# EAGLE design SO-8-minimal (EAGLE 6.5.0)
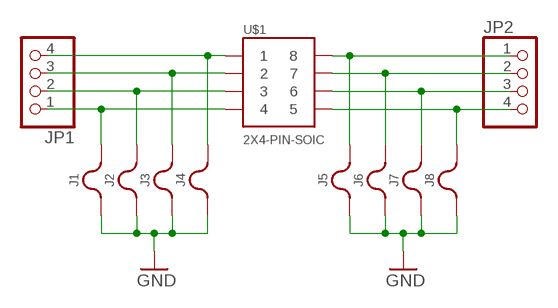
[diagram p0: schematic, sheet 1]

## Parts
J1  JUMPER-0805  [RCLJ-0805]
J2  JUMPER-0805  [RCLJ-0805]
J3  JUMPER-0805  [RCLJ-0805]
J4  JUMPER-0805  [RCLJ-0805]
J5  JUMPER-0805  [RCLJ-0805]
J6  JUMPER-0805  [RCLJ-0805]
J7  JUMPER-0805  [RCLJ-0805]
J8  JUMPER-0805  [RCLJ-0805]
JP1  PINHD-1X4  [1X04]
JP2  PINHD-1X4  [1X04]
U$1  2X4-PIN-SOIC  [SO8]

## Nets
1: J4.2 JP1.4 U$1.P$1
2: J3.2 JP1.3 U$1.P$2
3: J2.2 JP1.2 U$1.P$3
4: J1.2 JP1.1 U$1.P$4
5: J8.2 JP2.4 U$1.P$5
6: J7.2 JP2.3 U$1.P$6
7: J6.2 JP2.2 U$1.P$7
8: J5.2 JP2.1 U$1.P$8
GND: J1.1 J2.1 J3.1 J4.1 J5.1 J6.1 J7.1 J8.1

## Library data of the parts
J1-J8 = p.peter-rcl:JUMPER
JP1 JP2 = pinhead:PINHD-1X4: PIN HEADER
U$1 = p.peter-pacakages:2X4-PIN

## Board
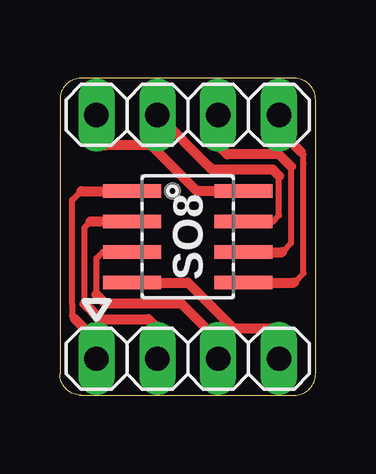
[diagram p1: board, top side]
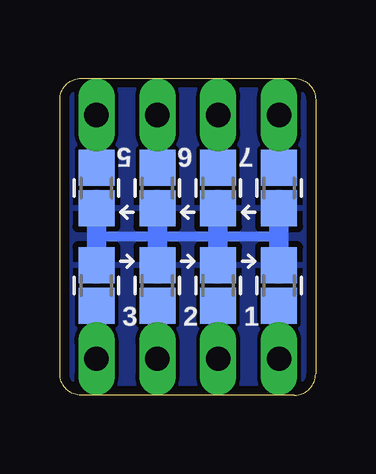
[diagram p2: board, bottom side, seen from below]

Size 10.67 x 13.21 mm. Coordinates in mm from the lower left corner, seen from the top.
Outline: 0.89,0 9.78,0 arc90 10.67,0.89 10.67,12.32 arc90 9.78,13.21 9.65,13.21 0.89,13.21 arc90 0,12.32 0,0.89 arc90 0.89,0
Copper layers (1*16): Top 0.0356mm / dielectric 1.5011mm / Bottom 0.0356mm
Design rules "oshpark": minimum track width 6mil, minimum drill 13mil, track to track 6mil, track to pad 6mil, pad to pad 6mil, via to via 6mil, smd to smd 6mil, copper to edge 15mil, drill to drill 6mil, minimum pad ring 7mil, minimum via ring 7mil, stop-mask expansion 4mil, vias tented up to drill 4.1mm, thermal gap 10mil

### Footprints (pad centres in the part's own frame; a part is rotated, then mirrored left to right if it is on the bottom)
RCLJ-0805 = smd 1.5 x 1.5: 1 -0.85,0; 2 0.85,0
1X04 = drill 1.016 long: 1 -3.81,0; 2 -1.27,0; 3 1.27,0; 4 3.81,0
SO8 = smd 0.559 x 2.413: P$1 -1.905,-2.324; P$2 -0.635,-2.324; P$3 0.635,-2.324; P$4 1.905,-2.324; P$5 1.905,2.324; P$6 0.635,2.324; P$7 -0.635,2.324; P$8 -1.905,2.324

### Placement (x,y rotation side)
J1  9.14,4.57 270 bottom
J2  6.6,4.57 270 bottom
J3  4.06,4.57 270 bottom
J4  1.52,4.57 270 bottom
J5  1.52,8.64 90 bottom
J6  4.06,8.64 90 bottom
J7  6.6,8.64 90 bottom
J8  9.14,8.64 90 bottom
JP1  5.33,1.52 180 top
JP2  5.33,11.68 0 top
U$1  5.33,6.6 270 top

### Tracks (layer width: path | path; a pad name or v marks a point on that pad's centre or on a via)
1
  Top 0.254: 0.89,8.51 0.51,8.13 0.51,3.81 0.51,3.3 0.64,3.18
  Top 0.406: 0.89,8.51 U$1.P$1 | 0.64,3.18 1.52,2.29 JP1.4
  Bottom 0.813: JP1.4 J4.2
2
  Top 0.254: 1.27,7.24 1.02,6.99 1.02,3.81
  Top 0.406: U$1.P$2 2.03,7.24 1.27,7.24 | 1.02,3.81 1.4,3.43 1.65,3.18 3.68,3.18 4.06,2.79 JP1.3
  Bottom 0.813: JP1.3 J3.2
3
  Top 0.254: 1.52,4.19 1.52,5.71 1.78,5.97 U$1.P$3
  Top 0.406: JP1.2 6.6,2.29 5.08,3.81 1.91,3.81 1.52,4.19
  Bottom 0.813: JP1.2 J2.2
4
  Top 0.406: U$1.P$4 5.33,4.7 6.1,3.94 7.24,2.79 8.89,2.79 9.14,2.54 JP1.1
  Bottom 0.813: JP1.1 J1.2
5
  Top 0.254: 9.78,4.7 10.16,5.08 10.16,9.65 10.16,10.03 10.03,10.16
  Top 0.406: U$1.P$5 9.78,4.7 | 10.03,10.16 9.14,11.05 JP2.4
  Bottom 0.813: JP2.4 J8.2
6
  Top 0.254: 9.27,5.97 9.65,6.35 9.65,9.53
  Top 0.406: U$1.P$6 9.27,5.97 | 9.65,9.53 9.14,10.03 6.98,10.03 6.6,10.41 JP2.3
  Bottom 0.813: JP2.3 J7.2
7
  Top 0.254: U$1.P$7 8.89,7.24 9.14,7.49 9.14,9.14
  Top 0.406: 9.14,9.14 8.89,9.4 6.35,9.4 6.22,9.53 JP2.2
  Bottom 0.813: JP2.2 J6.2
8
  Top 0.406: U$1.P$8 5.71,8.51 3.81,10.41 1.91,10.41 1.52,10.79 JP2.1
  Bottom 0.813: JP2.1 J5.2
GND
  Bottom 0.406: 1.52,6.6 4.06,6.6 6.6,6.6 9.14,6.6
  Bottom 0.813: J4.1 1.52,6.6 | 1.52,6.6 J5.1 1.52,6.6 | J1.1 9.14,6.6 J8.1 | J2.1 6.6,6.6 J7.1 | J6.1 4.06,6.6 J3.1
  pour Bottom: 0,0 0,13.21 10.67,13.21 10.67,0

### Text on the board
tPlace: SO8
bPlace: 7 | 6 | 5 | 1 | 2 | 3